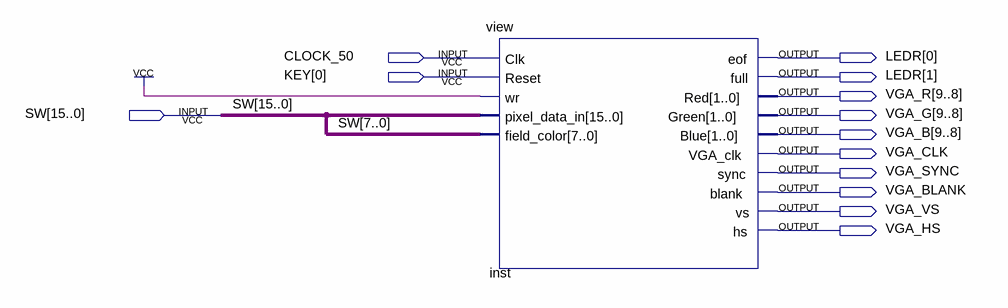
[diagram p0: schematic sheet]
// Quartus schematic viewtest.bdf as structural Verilog: 1 symbols, 13 pins
module viewtest (
  input  CLOCK_50,
  input  [0:0] KEY,
  input  [15:0] SW,
  output [1:0] LEDR,
  output [9:8] VGA_R,
  output [9:8] VGA_G,
  output [9:8] VGA_B,
  output VGA_CLK,
  output VGA_SYNC,
  output VGA_BLANK,
  output VGA_VS,
  output VGA_HS
);

  view inst (
    .Clk(CLOCK_50), .Reset(KEY[0]), .wr(1'b1), .pixel_data_in(SW), .field_color(SW[7:0]), .eof(LEDR[0]),
    .full(LEDR[1]), .Red(VGA_R), .Green(VGA_G), .Blue(VGA_B), .VGA_clk(VGA_CLK), .sync(VGA_SYNC),
    .blank(VGA_BLANK), .vs(VGA_VS), .hs(VGA_HS));
endmodule
